# EAGLE design power-linear-LP38692 (EAGLE 9.2.2)
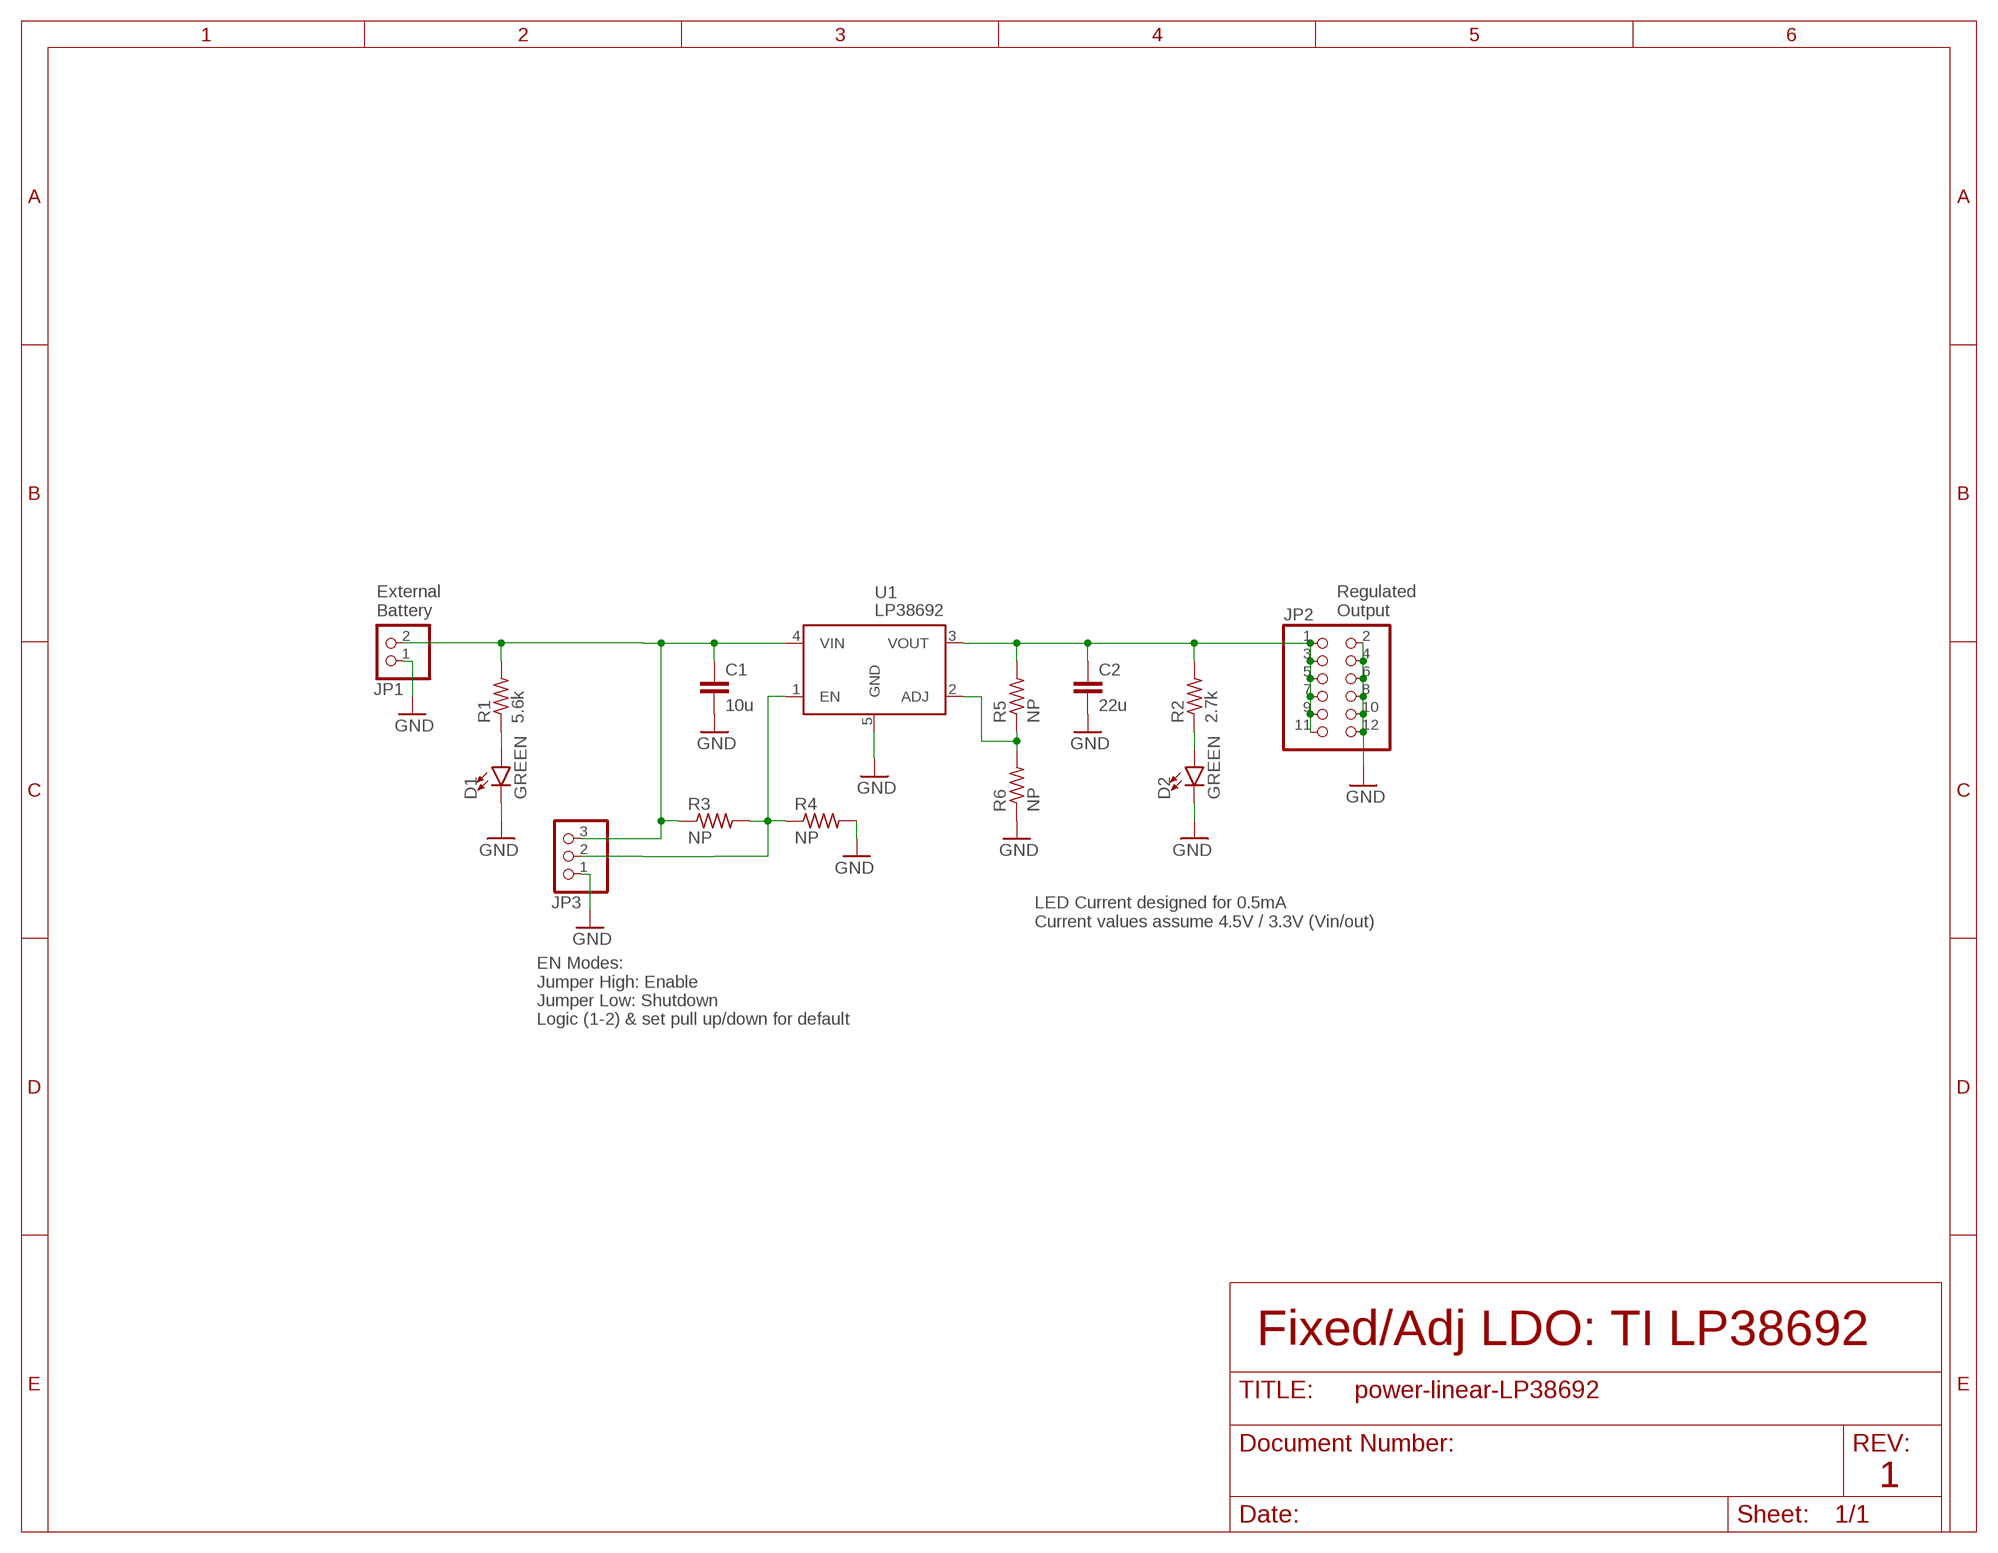
[diagram p0: schematic, sheet 1]

## Parts
C1  10u  C-EU0805-B-NOSILK  [.0805-B-NOSILK]
C2  22u  C-EU1206-B  [1206-B]
D1  GREEN  LED-GREEN0603  [LED-0603]
D2  GREEN  LED-GREEN0603  [LED-0603]
JP1  PINHD-1X2  [1X02]
JP2  PINHD-2X6  [2X06]
JP3  PINHD-1X3  [1X03]
R1  5.6k  R-US_0603-B-NOSILK  [.0603-B-NOSILK]
R2  2.7k  R-US_0603-B-NOSILK  [.0603-B-NOSILK]
R3  NP  R-US_0402-B-NOSILK  [.0402-B-NOSILK]
R4  NP  R-US_0402-B-NOSILK  [.0402-B-NOSILK]
R5  NP  R-US_0402-B-NOSILK  [.0402-B-NOSILK]
R6  NP  R-US_0402-B-NOSILK  [.0402-B-NOSILK]
U1  LP38692  [SOT223-5]

## Nets
+VBAT: C1.1 JP1.2 JP3.3 R1.2 R3.1 U1.4(VIN)
+VOUT: C2.1 JP2.1 JP2.3 JP2.5 JP2.7 JP2.9 JP2.11 R2.2 R5.2 U1.3(VOUT)
GND: C1.2 C2.2 D1.C D2.C JP1.1 JP2.2 JP2.4 JP2.6 JP2.8 JP2.10 JP2.12 JP3.1 R4.2 R6.1 U1.5(GND)
N$1: R5.1 R6.2 U1.2(ADJ)
N$2: JP3.2 R3.2 R4.1 U1.1(EN)
N$4: D1.A R1.1
N$78: D2.A R2.1

## Notes on the sheet
- External
  Battery
- Regulated
  Output
- LED Current designed for 0.5mA
  Current values assume 4.5V / 3.3V (Vin/out)
- EN Modes:
  Jumper High: Enable
  Jumper Low: Shutdown
  Logic (1-2) & set pull up/down for default
- Fixed/Adj LDO: TI LP38692
- 1

## Library data of the parts
C1 C2 = oresat-rcl:C-EU: CAPACITOR, European symbol
D1 D2 = SparkFun-LED:LED-GREEN: Green SMD LED Used in manufacturing of various products at SparkFun Packages: 0603 - SMD 0603 package [Product Link] <http://www.futureelectronics.com/en/technologies/semiconductors/optoelectronics/leds/Pages/9894312-LTST-C190GKT.aspx?CrossPart=HSMG-C190&IM=0> LilyPad 1206 - SMD1206 LilyPad package [Product Link] <http://www.futureelectronics.com/en/Technologies/Product.aspx?ProductID=IN150NGHARVATEKCORPORATION2049943&IM=0> 1206 - SMD1206 package [Product Link] <http://www.futureelectronics.com/en/technologies/semiconductors/optoelectronics/leds/Pages/8315665-LTST-C150KGKT.aspx?IM=0> 1206 Bottom Mount -SMD 1206 Bottom Mount [Product Link] <http://www.digikey.com/product-detail/en/lite-on-inc/LTST-C230KGKT/160-1456-1-ND/386854> SparkFun Products: Pro Mini 328 -5V <https://www.sparkfun.com/products/821> RedBoard <https://www.sparkfun.com/products/12757> MP3 Trigger <https://www.sparkfun.com/products/13720> Makey Makey <https://www.sparkfun.com/products/11076>
JP1 = pinhead:PINHD-1X2: PIN HEADER
JP2 = pinhead:PINHD-2X6: PIN HEADER
JP3 = pinhead:PINHD-1X3: PIN HEADER
R1-R6 = oresat-rcl:R-US_: RESISTOR, American symbol
U1 = U-TI-LP38692-linear-reg:LP38692: TI 1A LDO Regulators LP38692 Fixed Source: Datasheet <http://www.ti.com/product/LP38692?qgpn=lp38692> LP38692 Adjustable Source: Datasheet <http://www.ti.com/product/LP38692-ADJ?qgpn=lp38692-adj>

## Board
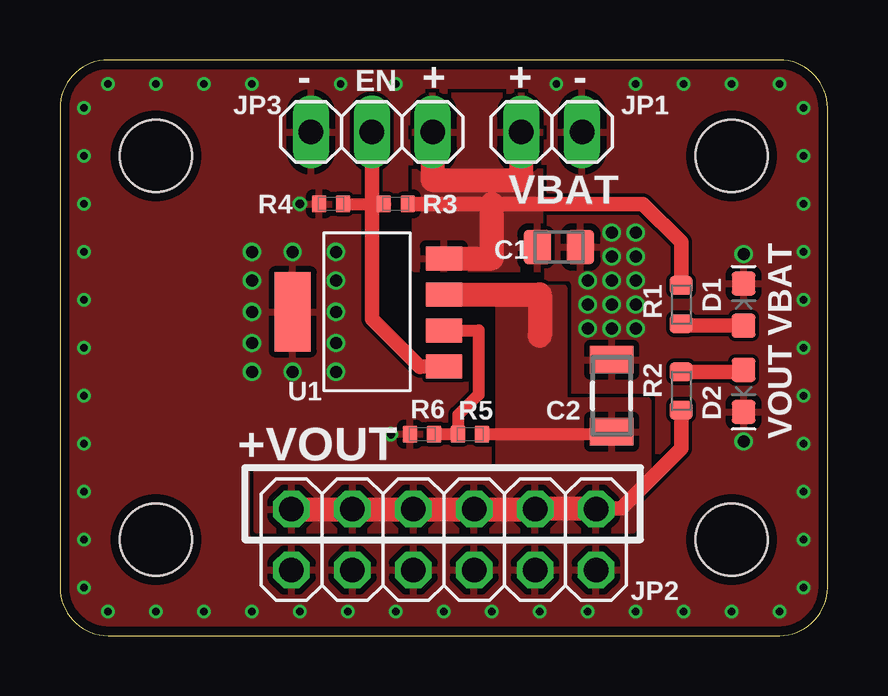
[diagram p1: board, top side]
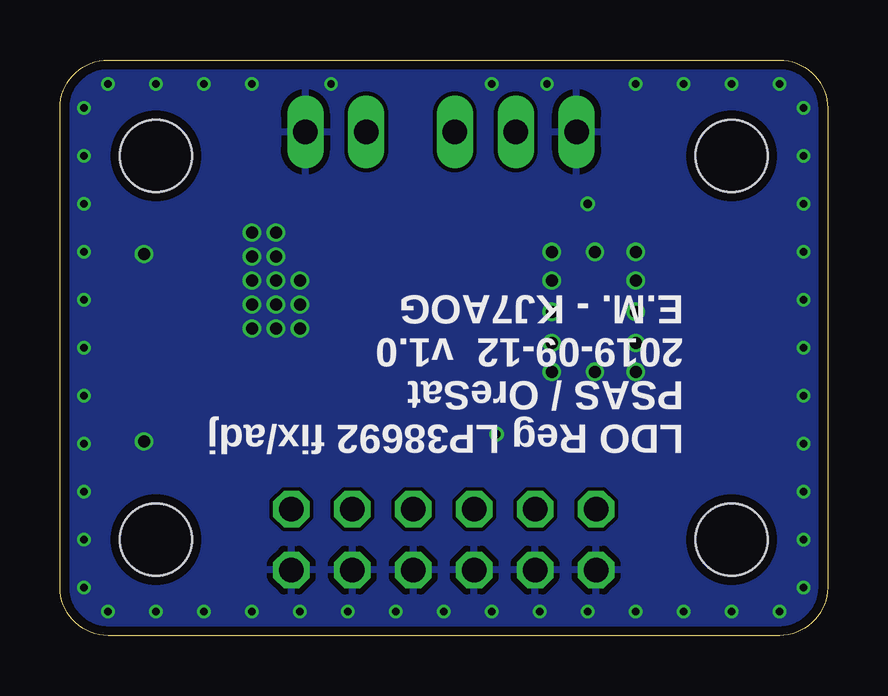
[diagram p2: board, bottom side, seen from below]

Size 32 x 24 mm. Coordinates in mm from the lower left corner, seen from the top.
Outline: 0,22 0,2 arc90 2,0 30,0 arc90 32,2 32,22 arc90 30,24 2,24 arc90 0,22
Copper layers (1*16): Top 0.035559375mm / dielectric 1.6mm / Bottom 0.035559375mm
Design rules "oshpark-2layer-tented": minimum track width 6mil, minimum drill 10mil, track to track 6mil, track to pad 6mil, pad to pad 6mil, via to via 6mil, smd to smd 6mil, copper to edge 15mil, drill to drill 6mil, minimum pad ring 5mil, minimum via ring 5mil, stop-mask expansion 2.5mil, vias tented up to drill 20mil, thermal gap 10mil
Holes 3 mm at 4,4 4,20 28,20 28,4

### Footprints (pad centres in the part's own frame; a part is rotated, then mirrored left to right if it is on the bottom)
.0805-B-NOSILK = smd 1.15 x 1.45: 1 -0.9,0; 2 0.9,0
1206-B = smd 1.15 x 1.8: 1 -1.5,0; 2 1.5,0
LED-0603 = smd 1 x 1: A -0.877,0; C 0.877,0
1X02 = drill 1.016 long: 1 -1.27,0; 2 1.27,0
2X06 = drill 1.016 octagon: 1 -6.35,-1.27; 2 -6.35,1.27; 3 -3.81,-1.27; 4 -3.81,1.27; 5 -1.27,-1.27; 6 -1.27,1.27; 7 1.27,-1.27; 8 1.27,1.27; 9 3.81,-1.27; 10 3.81,1.27; 11 6.35,-1.27; 12 6.35,1.27
1X03 = drill 1.016 long: 1 -2.54,0; 2 0,0; 3 2.54,0
.0603-B-NOSILK = smd 0.8 x 0.95: 1 -0.8,0; 2 0.8,0
.0402-B-NOSILK = smd 0.6 x 0.7: 1 -0.5,0; 2 0.5,0
SOT223-5 = smd 1 x 1.5: 1 -2.275,0; 2 -0.775,0; 3 0.725,0; 4 2.225,0 | smd 3.3 x 1.5: 5 0,6.3

### Placement (x,y rotation side)
C1  20.8,16.2 0 top
C2  23,10 90 top
D1  28.5,13.8 90 top
D2  28.5,10.2 270 top
JP1  20.5,21 180 top
JP2  16,4 180 top
JP3  13,21 0 top
R1  25.9,13.8 90 top
R2  25.9,10.2 270 top
R3  14,18 180 top
R4  11.3,18 180 top
R5  17.1,8.4 0 top
R6  15.1,8.4 0 top
U1  16,13.5 90 top

### Tracks (layer width: path | path; a pad name or v marks a point on that pad's centre or on a via)
+VBAT
  Top 0.6: R1.2 25.9,16.4 24.3,18 18,18 R3.1
  Top 1: JP3.3 15.54,19 19.23,19 JP1.2 | U1.4 18,15.72 18,18
  pour Top: 14.8,22.5 14.8,15.3 20,15.3 20,22.5
+VOUT
  Top 0.5: R5.2 22.9,8.4 C2.1
  Top 0.6: R2.2 25.9,7.8 23.4,5.3 22.38,5.3 JP2.1
  Top 1: U1.3 20,14.22 20,12.5 | JP2.11 JP2.9 JP2.7 JP2.5 JP2.3 19.81,5.3 22.38,5.3
  pour Top: 8.2,4.4 23.9,4.4 23.9,6.8 8.2,6.8
  pour Top: 24.5,6.8 18.3,6.8 18.3,14.5 21,14.5 21,9.8 24.5,9.8
GND  (via drill 0.3, 0.35, 0.5)
  other vias: 8,13.5 11.5,13.5 9.7,16 8,16 8,14.8 9.7,11 8,11 8,12.2 11.5,16 11.5,14.8 11.5,11 11.5,12.2 28.5,8.1 28.5,15.9 1,2 1,4 1,6 1,8 1,18 1,20 1,22 2,23 4,23 6,23 8,23 30,23 31,22 28,23 26,23 24,23 11.7,23 14,23 20.7,23 2,1 4,1 6,1 8,1 10,1 12,1 14,1 16,1 18,1 20,1 22,1 30,1 31,2 28,1 26,1 24,1 31,4 31,6 31,8 31,10 31,12 31,14 31,16 31,18 31,20 1,16 1,14 1,12 1,10 22,12.8 23,12.8 24,12.8 22,13.8 23,13.8 24,13.8 23,14.8 24,14.8 24,15.8 23,15.8 23,16.8 22,14.8 24,16.8 10,18 13.8,8.4
  pour Top (rank 2): 0,24 0,0 32,0 32,24
  pour Bottom: 0,24 0,0 32,0 32,24
N$1
  Top 0.5: U1.2 17.45,12.72 17.45,10.05 16.6,9.2 R5.1 R6.2
N$2
  Top 0.5: R4.1 13,18
  Top 0.6: JP3.2 13,18 | 13,18 13,13.2 15,11.2 15.03,11.22 U1.1 | R3.2 13,18
N$4
  Top 0.6: R1.1 25.98,12.92 D1.A
N$78
  Top 0.6: R2.1 28.42,11 D2.A

### Text on the board
tPlace: - | EN | + | + | - | VBAT | VBAT | VOUT | +VOUT
bPlace: LDO Reg LP38692 fix/adj / PSAS / OreSat / 2019-09-12 v1.0 / E.M. - KJ7AOG